# EAGLE schematic mailbox-sensor (EAGLE 6.6.0)
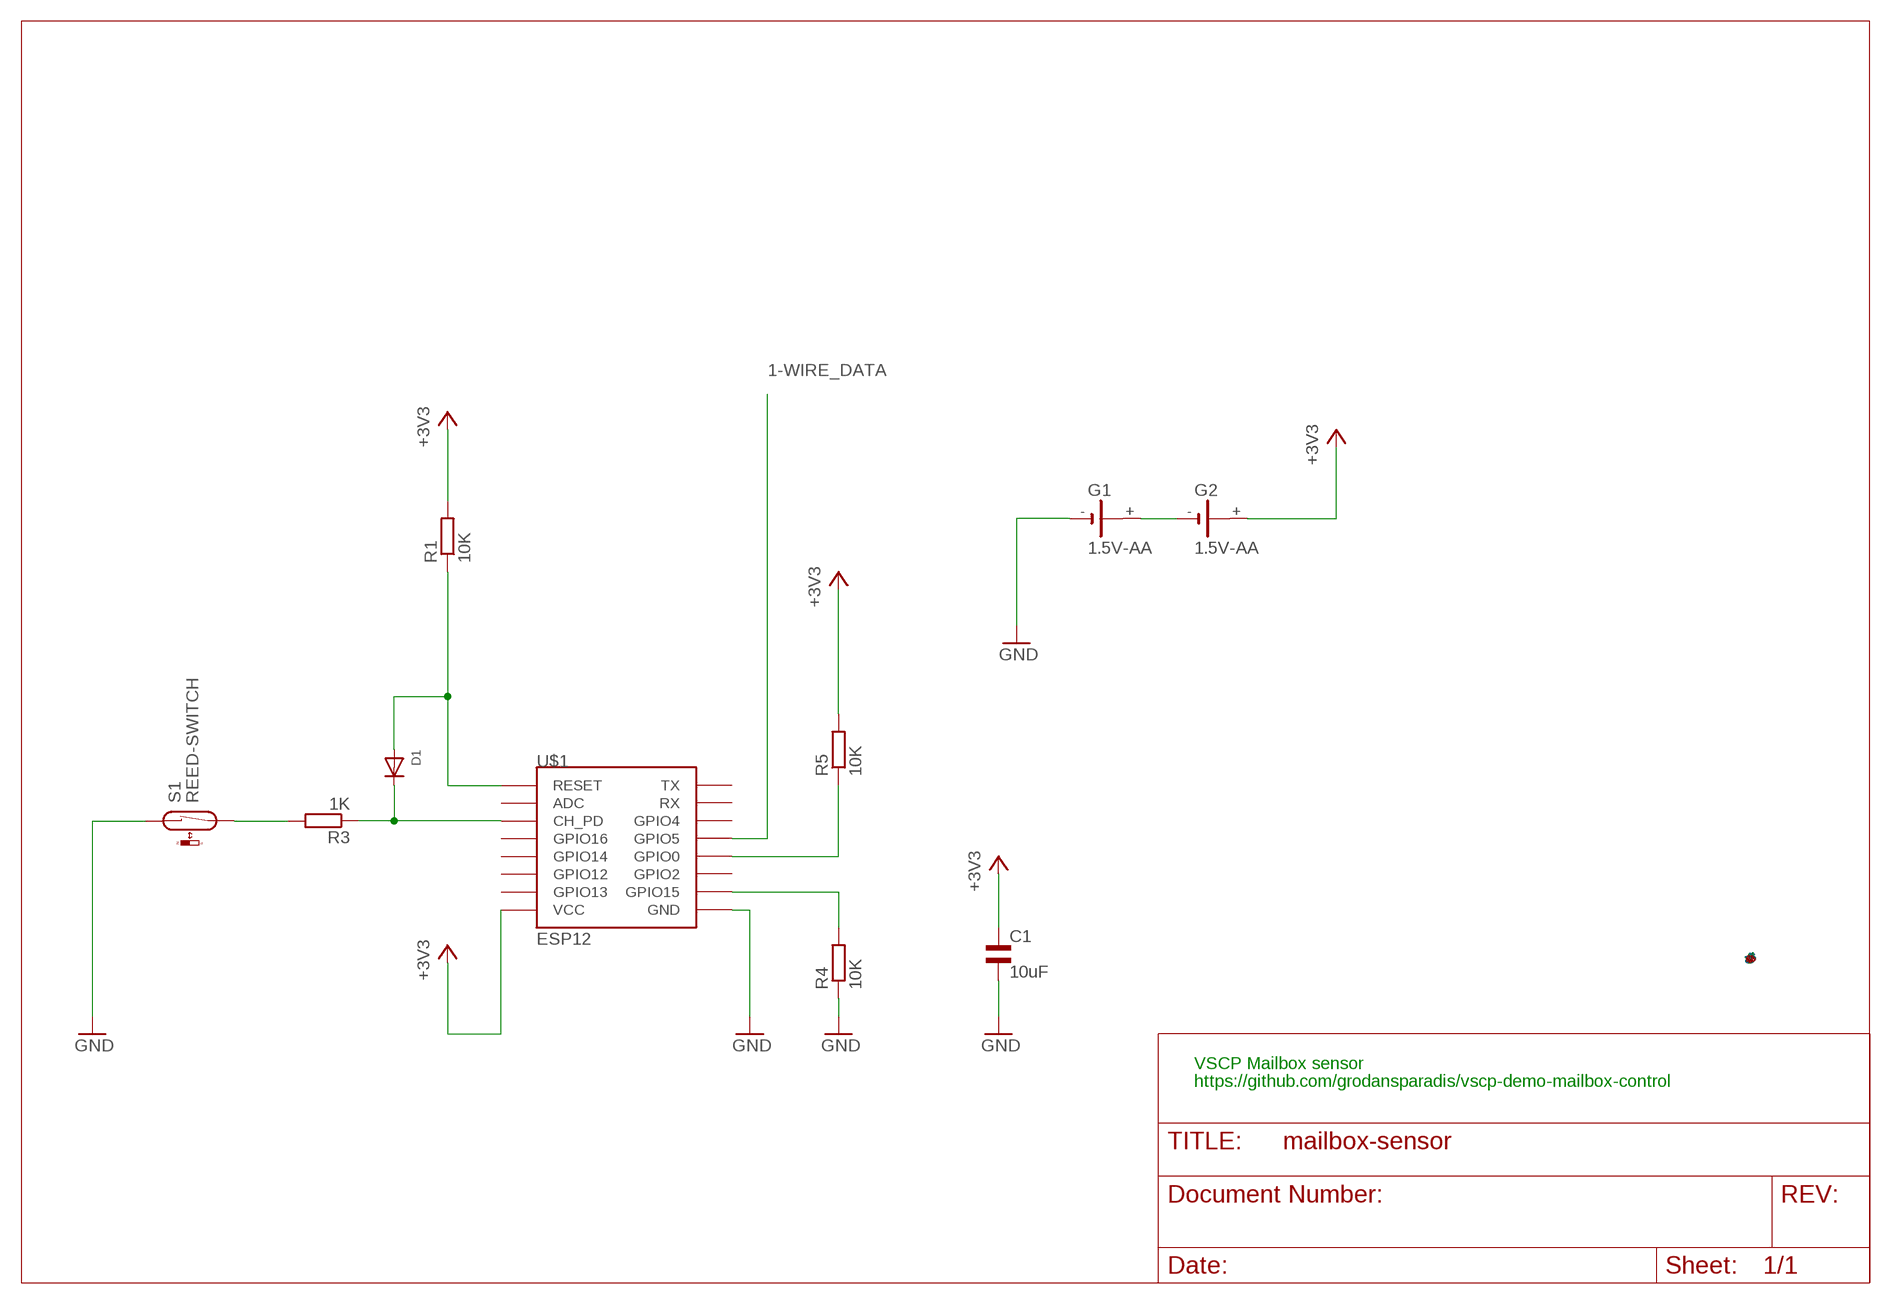
[diagram p0: schematic, sheet 1]

## Parts
C1  10uF  EL-BI35-12AXIAL  [EU35-12]
D1  DIODEDO-1N4148  [DO-1N4148]
G1  1.5V-AA  CR-AA  [CRAA]
G2  1.5V-AA  CR-AA  [CRAA]
R1  10K  R-EU_M0805  [M0805]
R3  1K  R-EU_M0805  [M0805]
R4  10K  R-EU_M0805  [M0805]
R5  10K  R-EU_M0805  [M0805]
S1  REED-SWITCH  REED-SWITCH-CT10-G4  [CT10-G4]
U$1  ESP12  [ESP12]
U$2  VSCP_LOGO  [VSCP_LOGO]

## Nets
1-WIRE_DATA: U$1.GPIO5
+3V3: C1.1 G2.+ R1.2 R5.2 U$1.VCC
GND: C1.2 G1.- R4.1 S1.1 U$1.GND
N$1: D1.C R3.1 U$1.CH_PD
N$2: D1.A R1.1 U$1.RESET
N$3: R4.2 U$1.GPIO15
N$4: R5.1 U$1.GPIO0
N$5: G1.+ G2.-
N$6: R3.2 S1.2
Unconnected: G1.+@1(+) G2.+@1(+) U$1.ADC U$1.GPIO2 U$1.GPIO4 U$1.GPIO12 U$1.GPIO13 U$1.GPIO14 U$1.GPIO16 U$1.RX U$1.TX

## Notes on the sheet
- VSCP Mailbox sensor
- https://github.com/grodansparadis/vscp-demo-mailbox-control

## Library data of the parts
C1 = rcl:EL-: BIPOLAR ELECTROLYTIC CAPACITOR
D1 = adafruit:DIODE: Diode SMADIODE - SMA Surface Mount Package 20V 1A Schottky Diode Digikey: 641-1014-6-ND DO-1N4148 - Through Hole Small Current Diode SOD-123 20V 1 A (.5mV Vf) Schottky Diode - Digikey: MBRX120TPMSCT-ND SOD-323 10V 570mA (.38mV Vf, 3ns) Schottky Diode - Digikey: ZLLS410CT-ND SOD-523 30V 30mA Schottky Diode (RB751S-40TE61) - Digikey: RB751S-40TE61CT-ND SOT23-R/W - SOT23 Package (R = Solder Paste/Reflow Ovens, W = Hand-Soldering) BAT54Film 40V 300mA - Digikey: 497-7162-1-ND
G1 G2 = battery:CR-AA: LI BATTERY Varta CRAA-SLF
R1 R3-R5 = rcl:R-EU_: RESISTOR, European symbol
S1 = switch-reed:REED-SWITCH-: Reed Sensor; OC_FARNELL: unknown
U$1 = esp8266modules:ESP12: ESP8266 Wifi module 12
U$2 = VSCP_logo:VSCP_LOGO